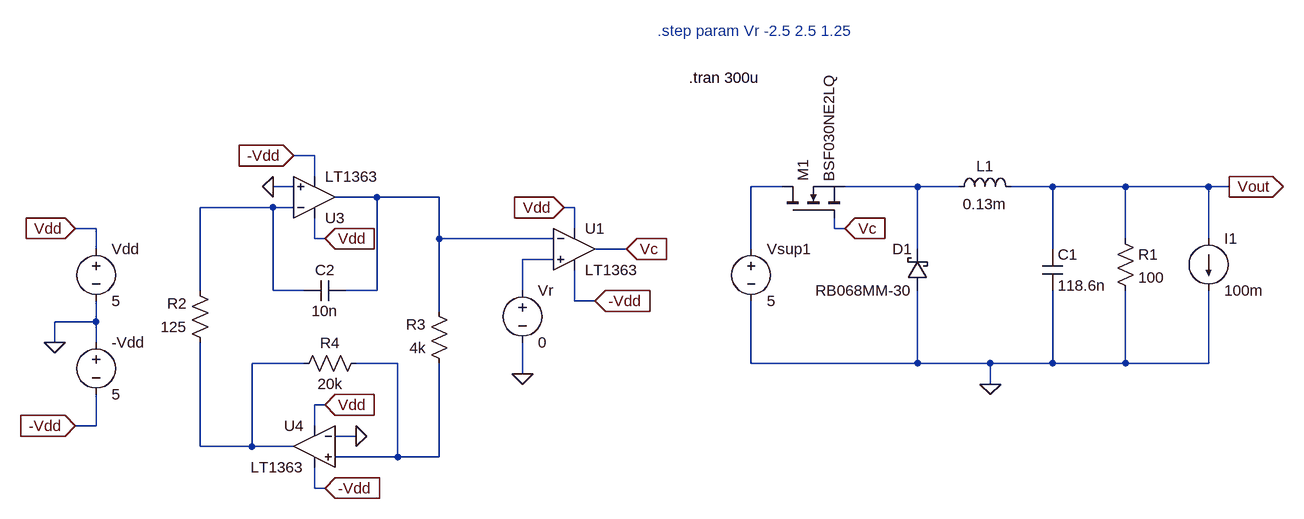
[diagram p0: schematic Q2.asc]
Q2.asc, the LTspice schematic file:
Version 4
SHEET 1 2092 844
WIRE -704 272 -736 272
WIRE -704 304 -704 272
WIRE -736 320 -768 320
WIRE 16 320 -32 320
WIRE 224 320 112 320
WIRE 288 320 224 320
WIRE 432 320 368 320
WIRE 544 320 432 320
WIRE 672 320 544 320
WIRE 704 320 672 320
WIRE -608 336 -672 336
WIRE -512 336 -608 336
WIRE -768 352 -880 352
WIRE -736 352 -768 352
WIRE -304 352 -320 352
WIRE -1040 384 -1072 384
WIRE -304 384 -304 352
WIRE 96 384 96 368
WIRE 112 384 96 384
WIRE -704 400 -704 368
WIRE -688 400 -704 400
WIRE -512 400 -512 336
WIRE -336 400 -512 400
WIRE 544 400 544 320
WIRE 672 400 672 320
WIRE -1040 416 -1040 384
WIRE -224 416 -272 416
WIRE -32 416 -32 320
WIRE 224 416 224 320
WIRE 432 416 432 320
WIRE -336 432 -384 432
WIRE -880 480 -880 352
WIRE -768 480 -768 352
WIRE -720 480 -768 480
WIRE -608 480 -608 336
WIRE -608 480 -656 480
WIRE -384 480 -384 432
WIRE -304 496 -304 448
WIRE -272 496 -304 496
WIRE -512 512 -512 400
WIRE -1040 528 -1040 496
WIRE -1040 528 -1104 528
WIRE -1104 560 -1104 528
WIRE -1040 560 -1040 528
WIRE -720 592 -800 592
WIRE -576 592 -640 592
WIRE -32 592 -32 496
WIRE 224 592 224 480
WIRE 224 592 -32 592
WIRE 336 592 224 592
WIRE 432 592 432 480
WIRE 432 592 336 592
WIRE 544 592 544 480
WIRE 544 592 432 592
WIRE 672 592 672 480
WIRE 672 592 544 592
WIRE -384 608 -384 560
WIRE 336 624 336 592
WIRE -688 656 -704 656
WIRE -1040 688 -1040 640
WIRE -1040 688 -1072 688
WIRE -704 688 -704 656
WIRE -640 704 -672 704
WIRE -880 720 -880 560
WIRE -800 720 -800 592
WIRE -800 720 -880 720
WIRE -736 720 -800 720
WIRE -576 736 -576 592
WIRE -576 736 -672 736
WIRE -512 736 -512 592
WIRE -512 736 -576 736
WIRE -704 784 -704 752
WIRE -688 784 -704 784
FLAG 336 624 0
FLAG 704 320 Vout
IOPIN 704 320 Out
FLAG 112 384 Vc
IOPIN 112 384 In
FLAG -1072 688 -Vdd
IOPIN -1072 688 In
FLAG -1072 384 Vdd
IOPIN -1072 384 In
FLAG -1104 560 0
FLAG -688 400 Vdd
IOPIN -688 400 In
FLAG -736 272 -Vdd
IOPIN -736 272 In
FLAG -688 656 Vdd
IOPIN -688 656 In
FLAG -688 784 -Vdd
IOPIN -688 784 In
FLAG -768 320 0
FLAG -224 416 Vc
IOPIN -224 416 In
FLAG -640 704 0
FLAG -384 608 0
FLAG -272 496 -Vdd
IOPIN -272 496 In
FLAG -320 352 Vdd
IOPIN -320 352 In
SYMBOL ind 272 336 R270
WINDOW 0 32 56 VTop 2
WINDOW 3 5 56 VBottom 2
SYMATTR InstName L1
SYMATTR Value 0.13m
SYMBOL cap 416 416 R0
SYMATTR InstName C1
SYMATTR Value 118.6n
SYMBOL res 528 384 R0
SYMATTR InstName R1
SYMATTR Value 100
SYMBOL current 672 400 R0
SYMATTR InstName I1
SYMATTR Value 100m
SYMBOL voltage -32 400 R0
SYMATTR InstName Vsup1
SYMATTR Value 5
SYMBOL nmos 16 368 R270
SYMATTR InstName M1
SYMATTR Value BSF030NE2LQ
SYMBOL schottky 240 480 R180
WINDOW 0 24 64 Left 2
WINDOW 3 24 0 Left 2
SYMATTR InstName D1
SYMATTR Value RB068MM-30
SYMATTR Description Diode
SYMATTR Type diode
SYMBOL voltage -1040 400 R0
SYMATTR InstName Vdd
SYMATTR Value 5
SYMBOL voltage -1040 544 R0
SYMATTR InstName -Vdd
SYMATTR Value 5
SYMBOL res -864 576 R180
WINDOW 0 36 76 Left 2
WINDOW 3 36 40 Left 2
SYMATTR InstName R2
SYMATTR Value 125
SYMBOL res -496 608 R180
WINDOW 0 36 76 Left 2
WINDOW 3 36 40 Left 2
SYMATTR InstName R3
SYMATTR Value 4k
SYMBOL res -624 576 R90
WINDOW 0 0 56 VBottom 2
WINDOW 3 32 56 VTop 2
SYMATTR InstName R4
SYMATTR Value 20k
SYMBOL cap -656 464 R90
WINDOW 0 0 32 VBottom 2
WINDOW 3 32 32 VTop 2
SYMATTR InstName C2
SYMATTR Value 10n
SYMBOL opamps/LT1363 -704 400 M180
SYMATTR InstName U3
SYMBOL opamps/LT1363 -704 656 M0
SYMATTR InstName U4
SYMBOL opamps/LT1363 -304 352 R0
SYMATTR InstName U1
SYMBOL voltage -384 464 R0
SYMATTR InstName Vr
SYMATTR Value 0
TEXT -128 152 Left 2 !.tran 300u
TEXT -176 80 Left 2 ;.step param Vr -2.5 2.5 1.25

The netlist it stands for:
* Q2.asc
L1 N002 Vout 0.13m
C1 Vout 0 118.6n
R1 Vout 0 100
I1 Vout 0 100m
Vsup1 N001 0 5
M1 N001 Vc N002 N002 BSF030NE2LQ
D1 0 N002 RB068MM-30
Vdd Vdd 0 5
V§-Vdd 0 -Vdd 5
R2 N006 N004 125
R3 N007 N003 4k
R4 N007 N006 20k
C2 N003 N004 10n
XU3 0 N004 Vdd -Vdd N003 LT1363  ; pins In+ In- V+ V- OUT
XU4 N007 0 Vdd -Vdd N006 LT1363  ; pins In+ In- V+ V- OUT
XU1 N005 N003 Vdd -Vdd Vc LT1363  ; pins In+ In- V+ V- OUT
Vr N005 0 0
.model D D
.lib standard.dio
.model NMOS NMOS
.model PMOS PMOS
.lib standard.mos
.tran 300u
* .step param Vr -2.5 2.5 1.25
.lib LT1363.sub
.backanno
.end